# Altium schematic sheet 01-Antennas.SchDoc
size B; SheetNumber: 1; SheetTotal: 19; SPICEModelCacheELOCFEDZ: <root> / <DocumentId>ELOCFEDZ</DocumentId> / </root>
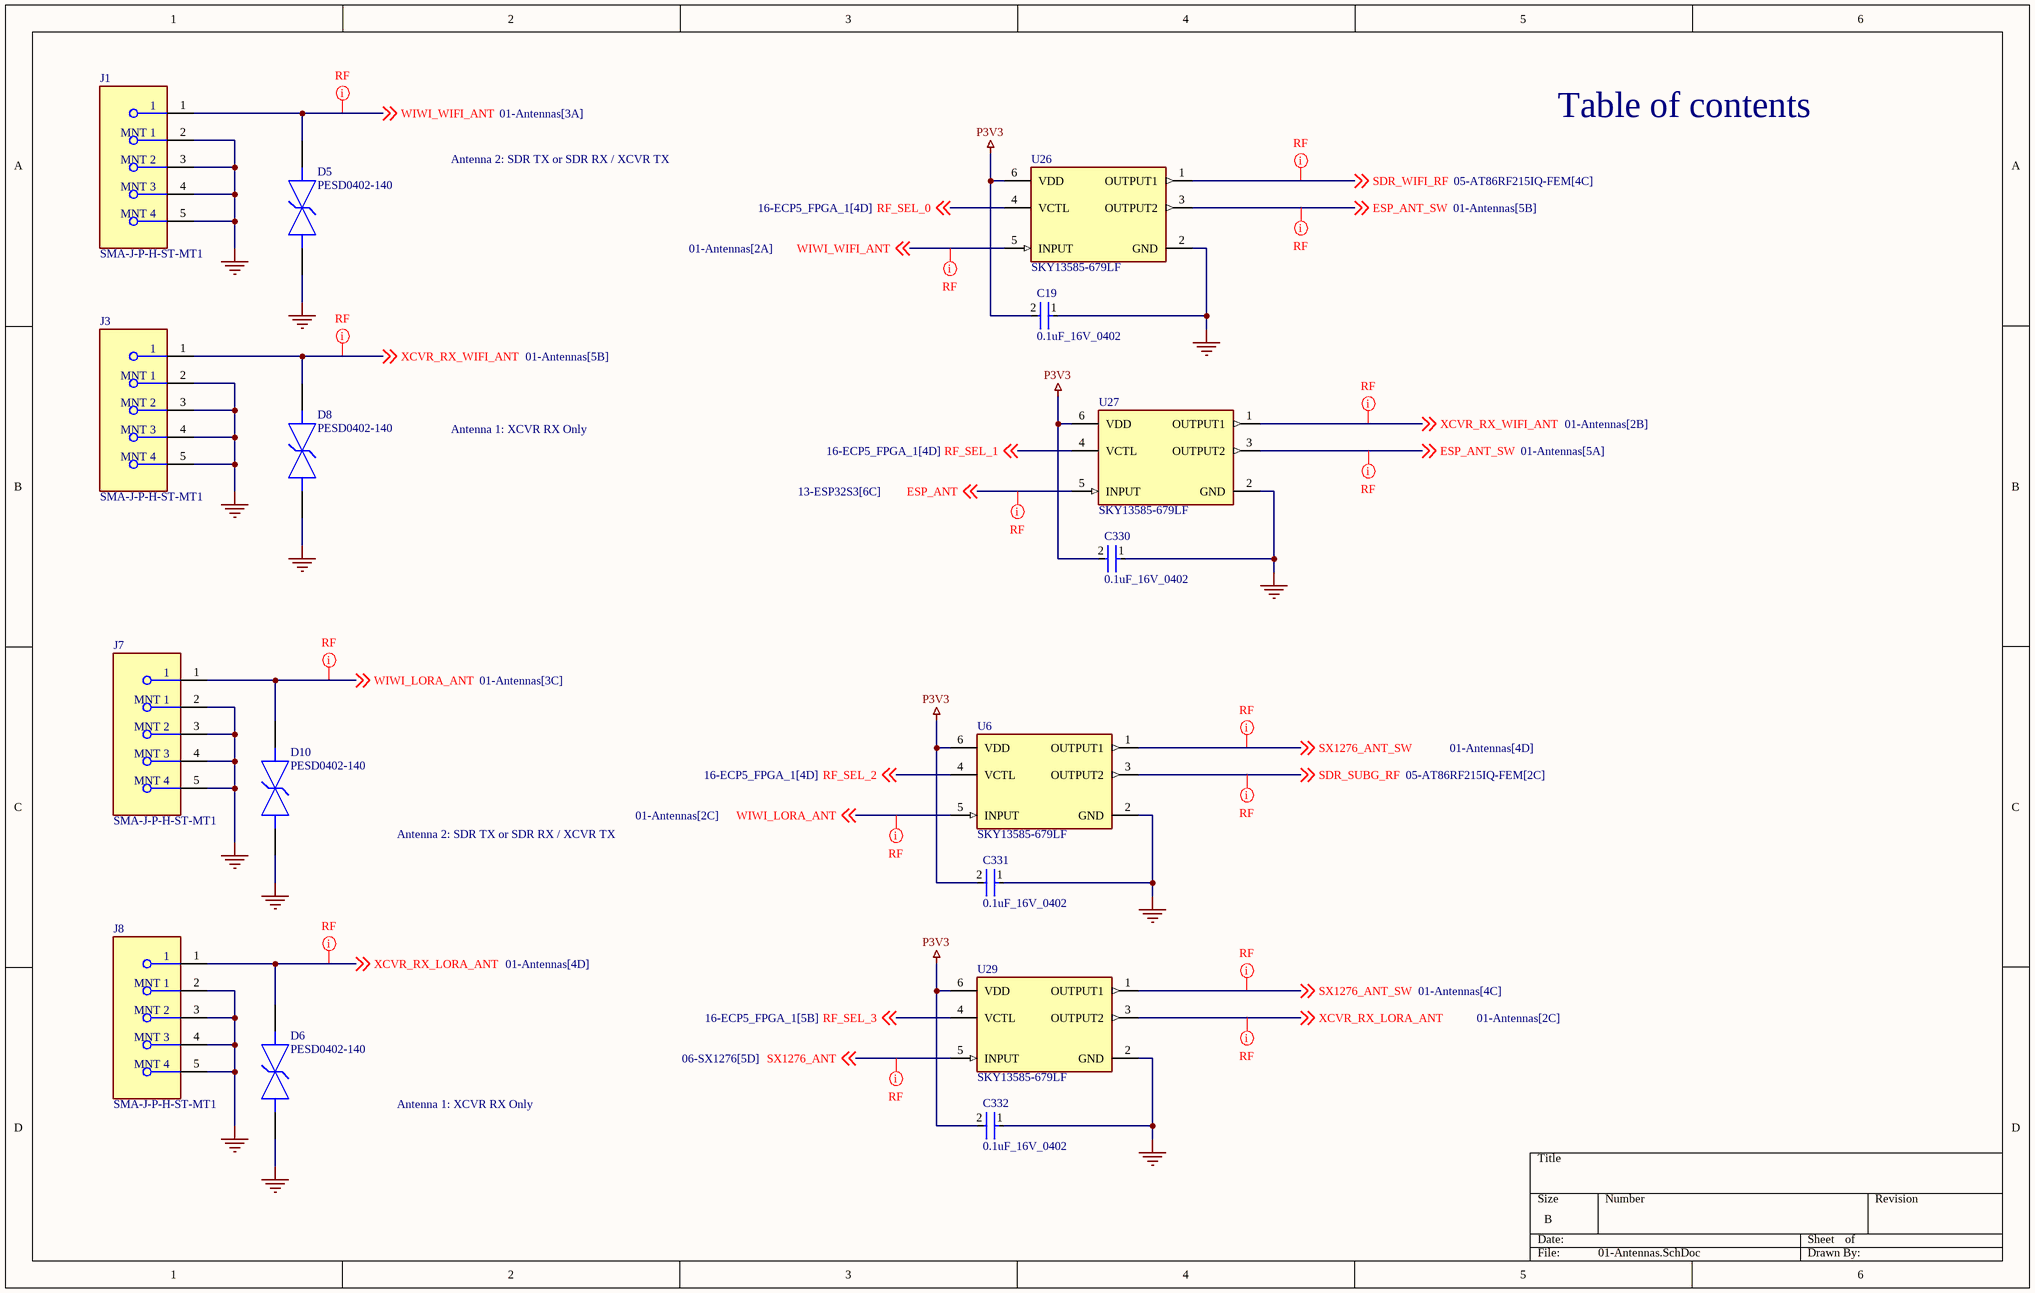
[diagram p0: 01-Antennas.SchDoc]

## Parts
C19  0.1uF_16V_0402  [FP-C0402-BB-MFG]
C330  0.1uF_16V_0402  [FP-C0402-BB-MFG]
C331  0.1uF_16V_0402  [FP-C0402-BB-MFG]
C332  0.1uF_16V_0402  [FP-C0402-BB-MFG]
D5  PESD0402-140  [FP-PESD0402-MFG]
D6  PESD0402-140  [FP-PESD0402-MFG]
D8  PESD0402-140  [FP-PESD0402-MFG]
D10  PESD0402-140  [FP-PESD0402-MFG]
J1  SMA-J-P-H-ST-MT1  [FP-SMA-J-P-H-ST-MT1-MFG]
J3  SMA-J-P-H-ST-MT1  [FP-SMA-J-P-H-ST-MT1-MFG]
J7  SMA-J-P-H-ST-MT1  [FP-SMA-J-P-H-ST-MT1-MFG]
J8  SMA-J-P-H-ST-MT1  [FP-SMA-J-P-H-ST-MT1-MFG]
U6  SKY13585-679LF  [FP-SKY13585-679LF-MFG]
U26  SKY13585-679LF  [FP-SKY13585-679LF-MFG]
U27  SKY13585-679LF  [FP-SKY13585-679LF-MFG]
U29  SKY13585-679LF  [FP-SKY13585-679LF-MFG]

## Nets
GND: C19.1 C330.1 C331.1 C332.1 D5.1 D6.1 D8.1 D10.1 J1.2(MNT_1) J1.3(MNT_2) J1.4(MNT_3) J1.5(MNT_4) J3.2(MNT_1) J3.3(MNT_2) J3.4(MNT_3) J3.5(MNT_4) J7.2(MNT_1) J7.3(MNT_2) J7.4(MNT_3) J7.5(MNT_4) J8.2(MNT_1) J8.3(MNT_2) J8.4(MNT_3) J8.5(MNT_4) U6.2(GND) U26.2(GND) U27.2(GND) U29.2(GND)
P3V3: C19.2 C330.2 C331.2 C332.2 U6.6(VDD) U26.6(VDD) U27.6(VDD) U29.6(VDD)
ESP_ANT: U27.5(INPUT) ; off-sheet ESP_ANT
ESP_ANT_SW: U26.3(OUTPUT2) U27.3(OUTPUT2) ; off-sheet ESP_ANT_SW
RF_SEL_0: U26.4(VCTL) ; off-sheet RF_SEL_0
RF_SEL_1: U27.4(VCTL) ; off-sheet RF_SEL_1
RF_SEL_2: U6.4(VCTL) ; off-sheet RF_SEL_2
RF_SEL_3: U29.4(VCTL) ; off-sheet RF_SEL_3
SDR_SUBG_RF: U6.3(OUTPUT2) ; off-sheet SDR_SUBG_RF
SDR_WIFI_RF: U26.1(OUTPUT1) ; off-sheet SDR_WIFI_RF
SX1276_ANT: U29.5(INPUT) ; off-sheet SX1276_ANT
SX1276_ANT_SW: U6.1(OUTPUT1) U29.1(OUTPUT1) ; off-sheet SX1276_ANT_SW
WIWI_LORA_ANT: D10.2 J7.1 U6.5(INPUT) ; off-sheet WIWI_LORA_ANT
WIWI_WIFI_ANT: D5.2 J1.1 U26.5(INPUT) ; off-sheet WIWI_WIFI_ANT
XCVR_RX_LORA_ANT: D6.2 J8.1 U29.3(OUTPUT2) ; off-sheet XCVR_RX_LORA_ANT
XCVR_RX_WIFI_ANT: D8.2 J3.1 U27.1(OUTPUT1) ; off-sheet XCVR_RX_WIFI_ANT

## Layout directives
net class RF: ESP_ANT, ESP_ANT_SW, SDR_SUBG_RF, SDR_WIFI_RF, SX1276_ANT, SX1276_ANT_SW, WIWI_LORA_ANT, WIWI_WIFI_ANT, XCVR_RX_LORA_ANT, XCVR_RX_WIFI_ANT

## Notes on the sheet
- Antenna 2: SDR TX or SDR RX / XCVR TX
- Table of contents
- Antenna 1: XCVR RX Only

## Library data of the parts
C19 C330-C332 = CMP-1034-02068-3: CAP CER 0.1UF 16V 5% X7R 0402; Manufacturer: Kemet; Manufacturer Part Number: C0402C104J4RACTU; Value: 0.10 μF; Temperature Coefficient: 15%; Tolerance: 0.05; Material: Ceramic; ComponentLink2URL: https://content.kemet.com/datasheets/KEM_C1002_X7R_SMD.pdf; Automotive: No; Device Class L2: Capacitors; Temperature: -55°C to +125°C; RoHS: TRUE; Voltage Rating: 16 V; ComponentLink2Description: Datasheet; Device Class L3: Ceramic Capacitors; Temperature Range Low: -55°C; Ipc Land Pattern Name: CAPC10050X50; Device Class L1: Passive Components; Temperature Range High: +125°C; Package: C0402-BB; Capacitance: 0.10 μF; Category: Cap; Mouser Description: CAP CER 0.1UF 16V X7R 0402; Height: 0.55mm; Digikey Description: CAP CER 0.1UF 16V 5% X7R 0402; Octopart: https://octopart.com/c0402c104j4ractu-kemet-12573893; Temperature Characteristic: X7R; Lead Free: Yes
D5 D6 D8 D10 = CMP-08607-000011-1: TVS DIODE 14V 40V 0402; Manufacturer: Littelfuse Inc.; Automotive Grade: Grade 1; Capacitance: 0.25pF; Value: 0.25pF; Direction: Bidirectional; Number Of Channels: 1; Temperature Range Low: -55°C; Lead Free: Yes; Temperature: -55°C to +125°C; Digikey Description: TVS DIODE 14V 40V 0402; Automotive: Yes; Device Class L2: TVS Diodes; Reverse Standoff Voltage: 14V; Device Class L1: Circuit Protection; Ipc Land Pattern Name: DIOC10050X33; Manufacturer Part Number: PESD0402-140; Breakdown Voltage: 14V; Height: 0.43mm; Clamping Voltage: 40V; RoHS: TRUE; Temperature Range High: +125°C; Device Class L3: unset; Octopart: https://octopart.com/pesd0402-140-littelfuse-74215061; Package: PESD0402; ComponentLink2URL: https://www.littelfuse.com/~/media/electronics/datasheets/polymer_esd_suppressors/littelfuse_polymer_esd_suppressor_pesd_catalog_datasheet.pdf.pdf; Category: Diode; ComponentLink2Description: Datasheet
J1 J3 J7 J8 = CMP-02754-000007-1: CONN SMA JACK STR 50 OHM SMD; Dielectric Material: PTFE; Voltage Rating: 335V; Body Material: Brass; Center Contact Plating: Gold; Impedance: 50R; Number of Ports: 1; Max Frequency: 20GHz; Mount: Surface Mount; Contact Plating: Gold; Housing Color: Gold; Series: -; Fastening Type: Threaded; Packaging: Bulk; Connector Type: SMA; Contact Material: Copper Alloy; Body Plating: Gold; Case/Package: SMA; Termination: Solder; RoHS Compliant: No; Min Operating Temperature: -65°C; Max Operating Temperature: 125°C
U6 U26 U27 U29 = CMP-85923-000009-1: IC RF SWITCH SPDT 6GHZ 6MLPD; Insertion Loss: 0.5dB; Impedance: 50R; IIP3: 56dBm; Test Frequency: 2.5GHz; Packaging: Cut Tape; Throw Configuration: SPDT; Max Operating Temperature: 90°C; RoHS Compliant: Yes; Min Operating Temperature: -40°C; Series: -